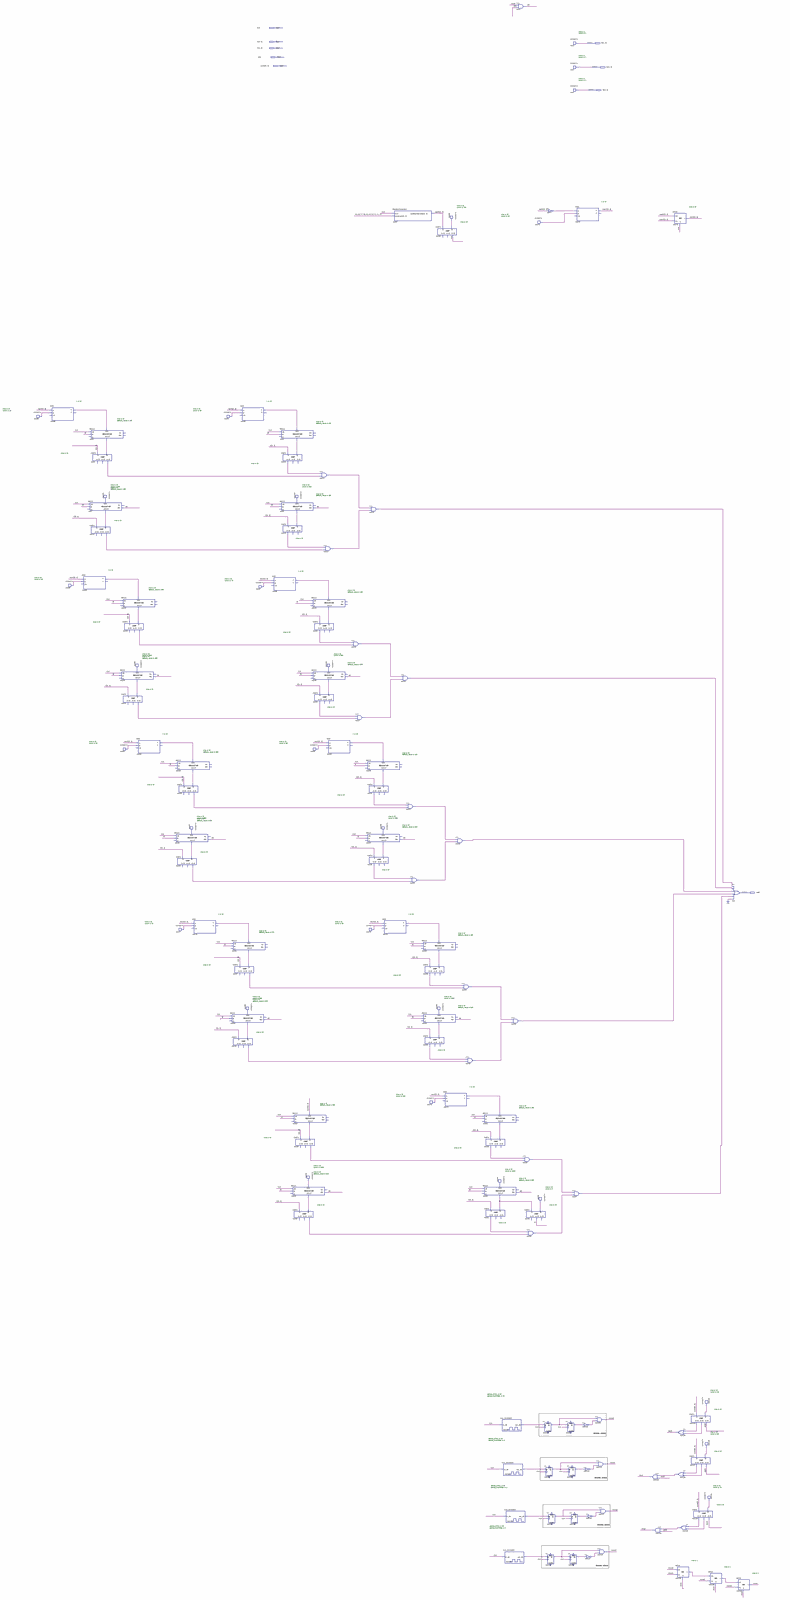
[diagram p0: schematic sheet, whole]
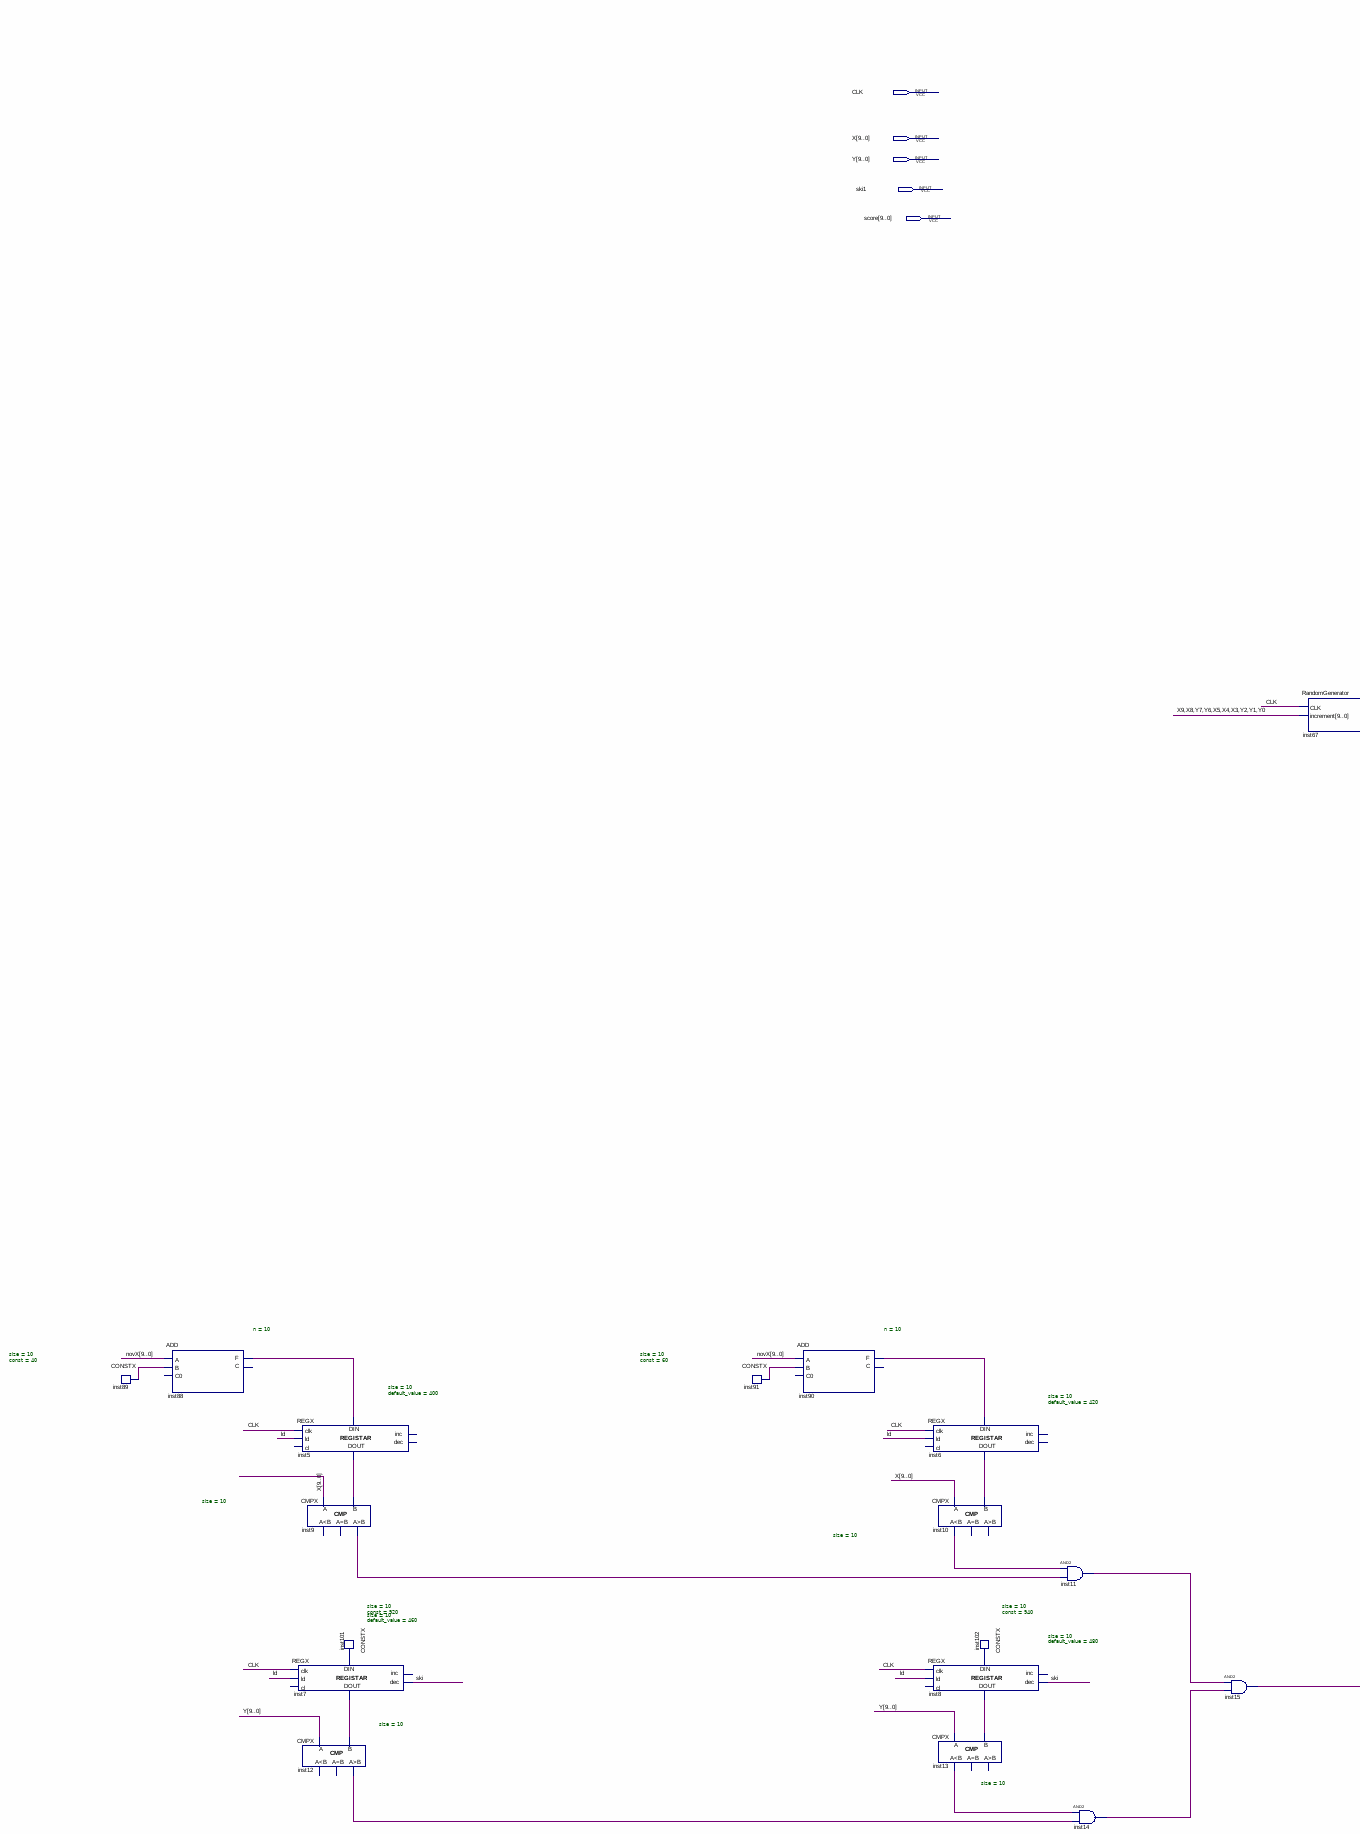
[diagram p1: schematic sheet, upper left part]
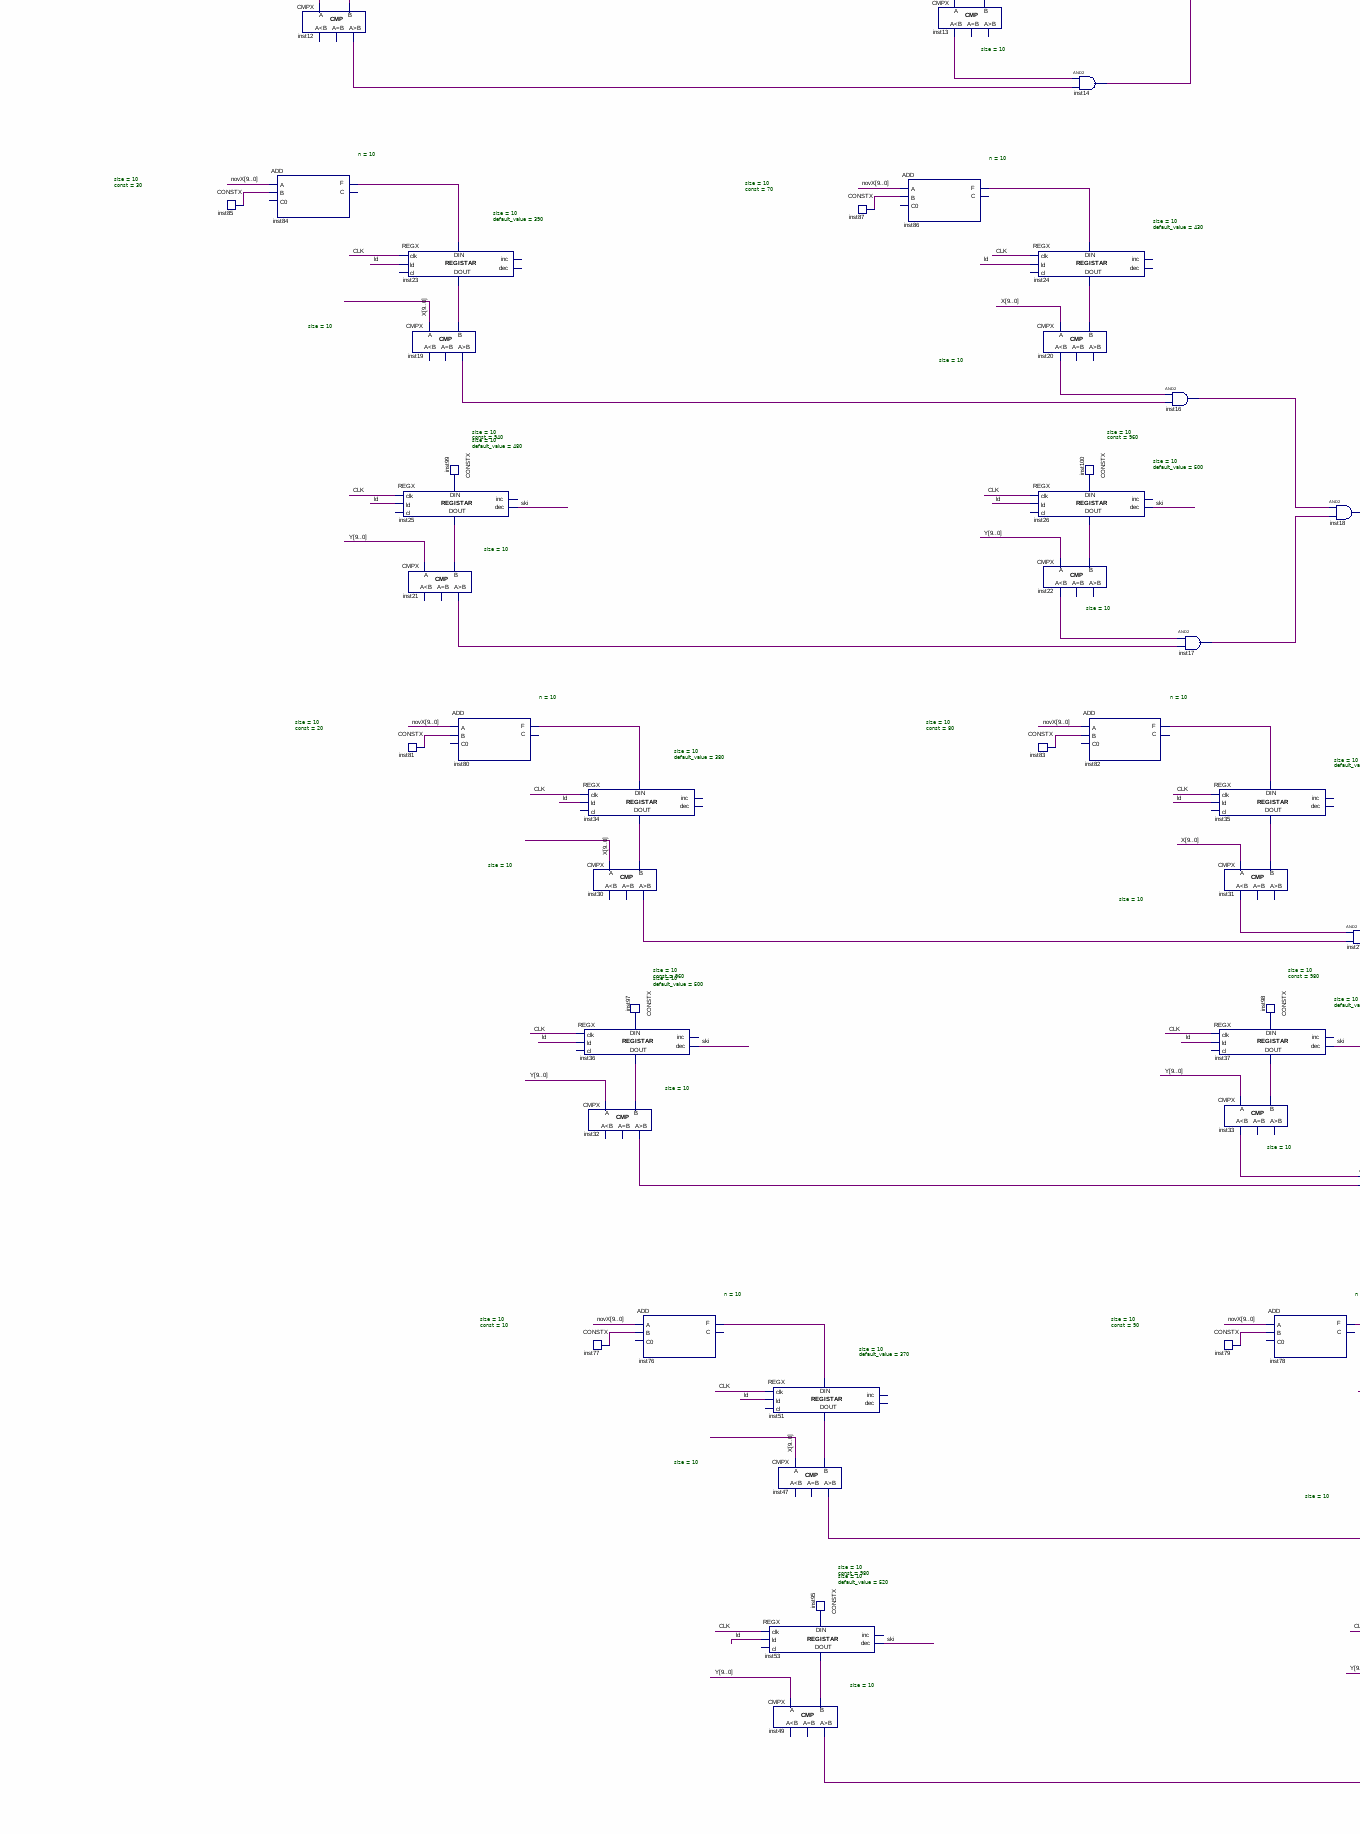
[diagram p2: schematic sheet, middle left part]
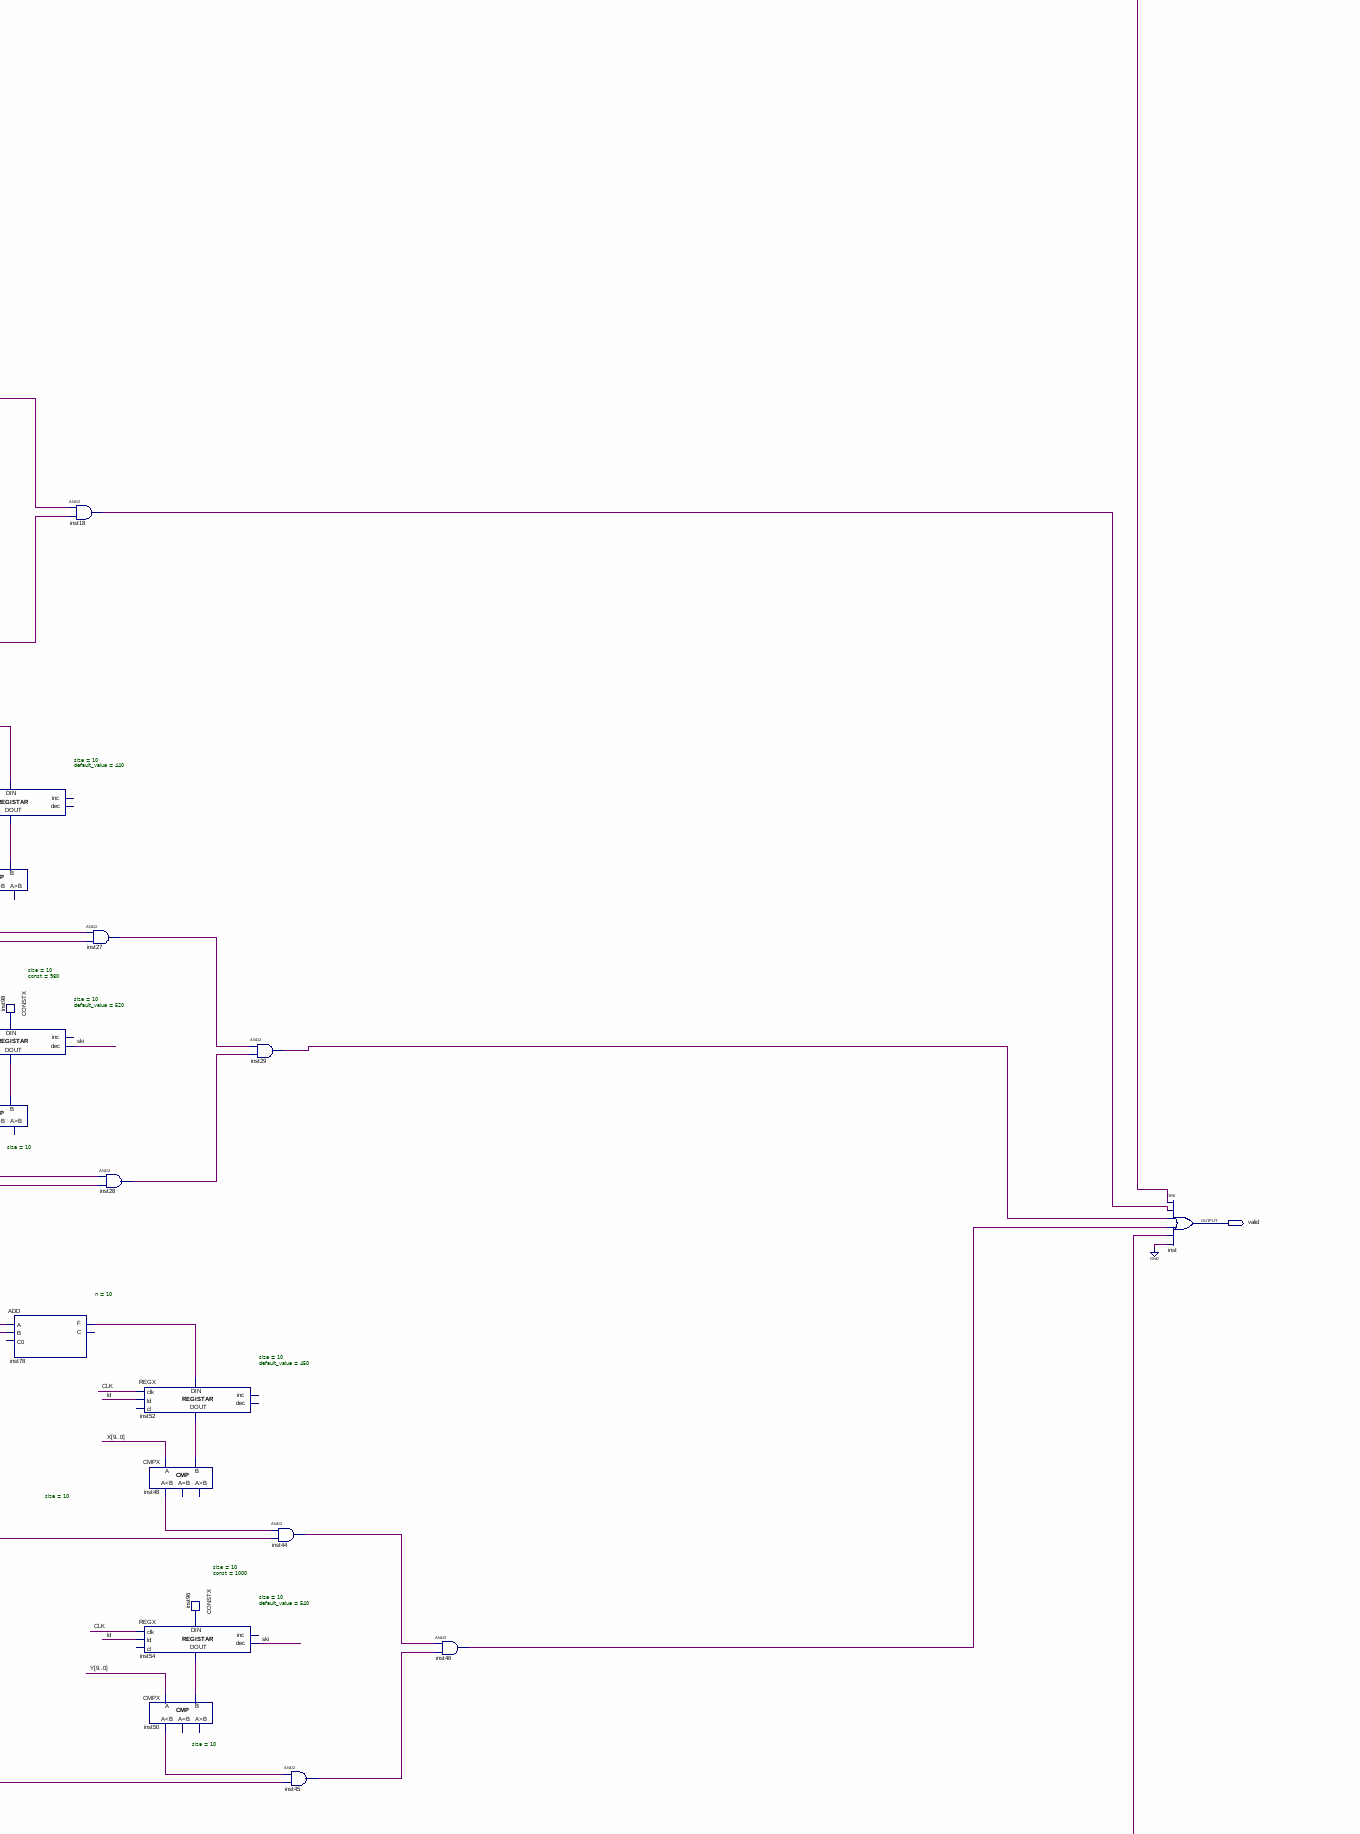
[diagram p3: schematic sheet, middle right part]
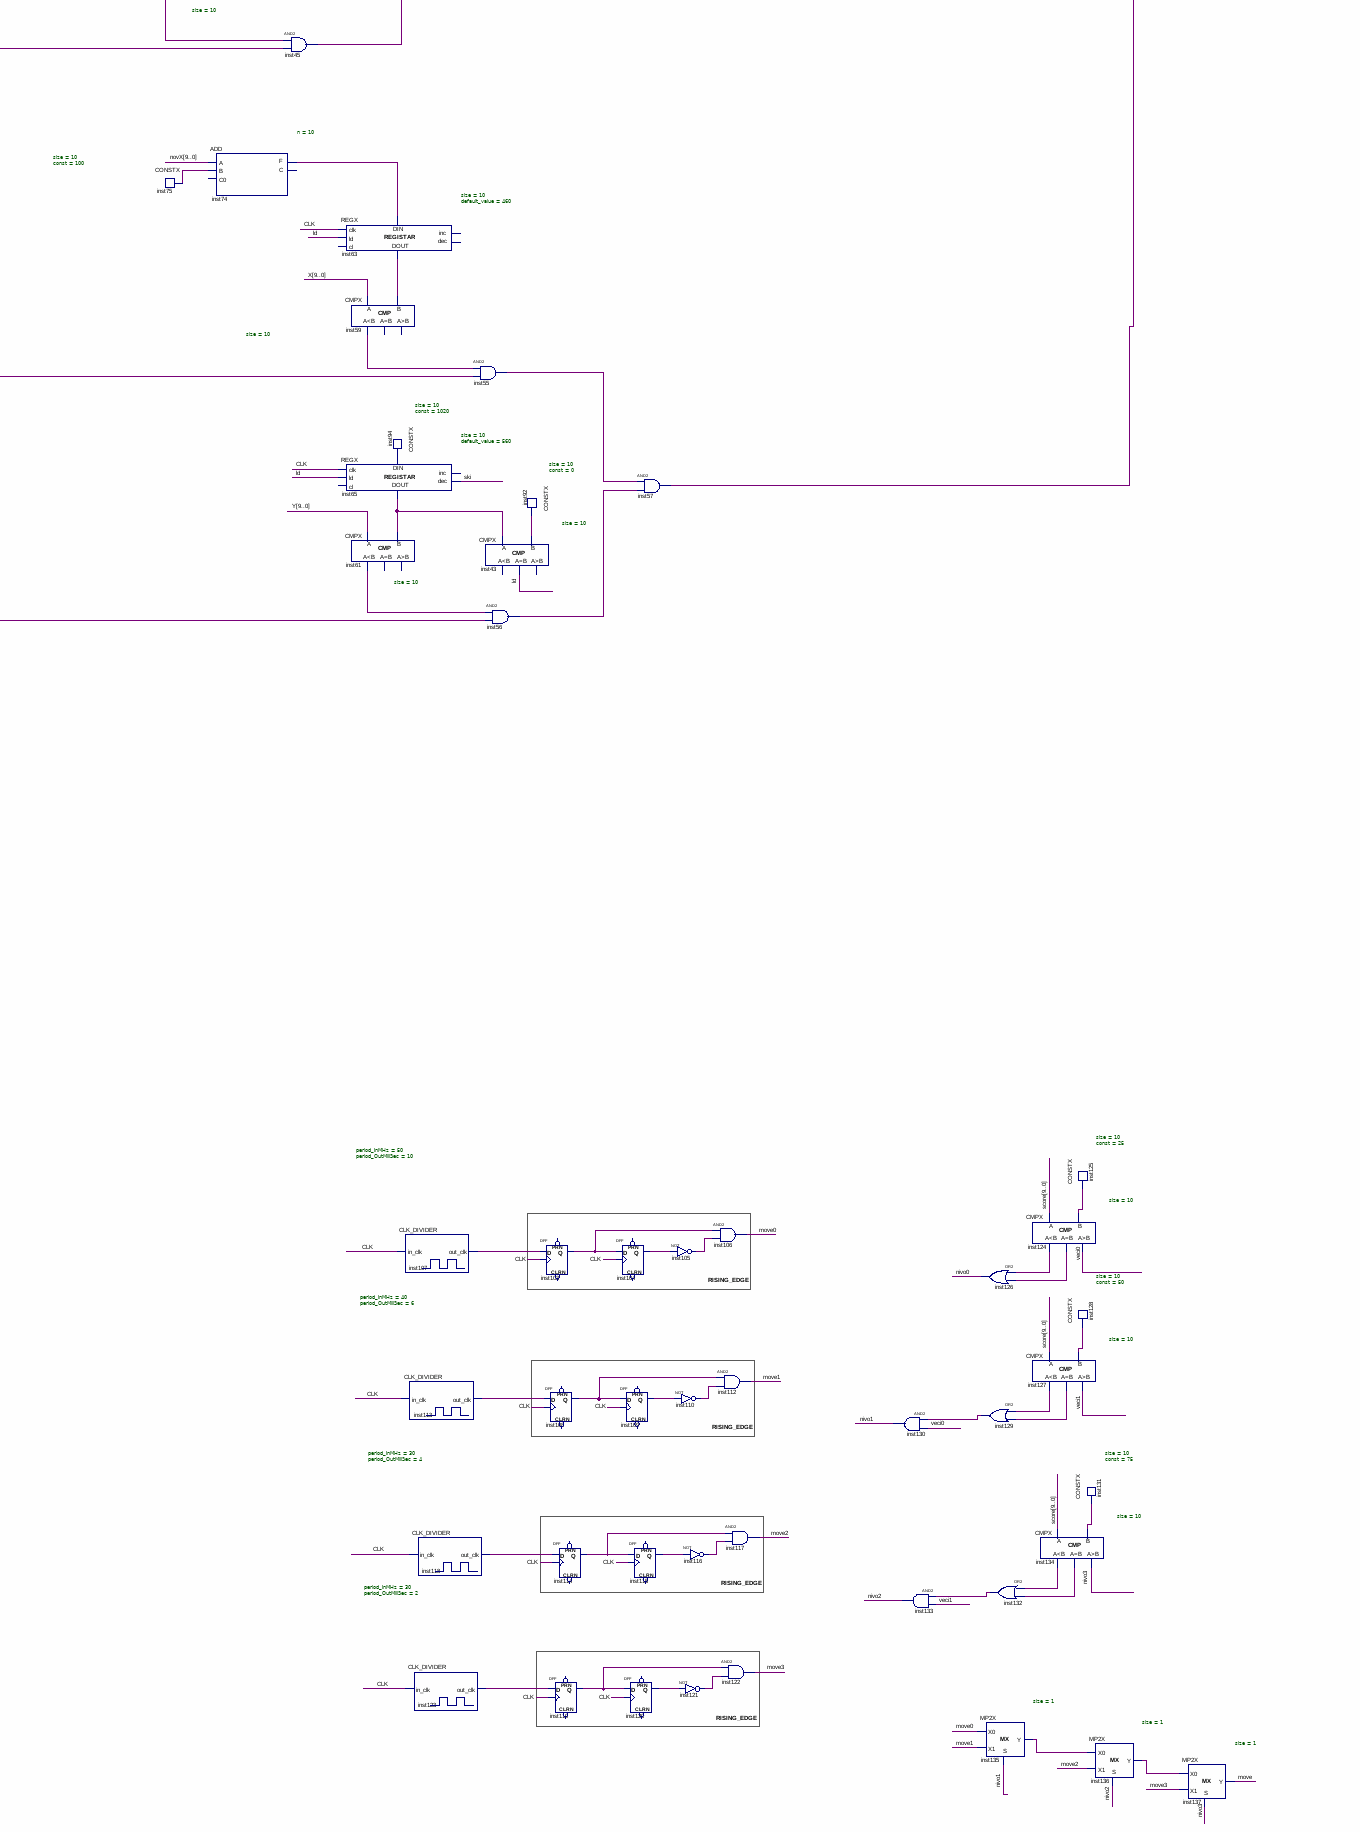
[diagram p4: schematic sheet, lower right part]
// Quartus schematic Jelkica.bdf as structural Verilog: 131 symbols, 9 pins
module Jelkica (
  input  CLK,
  input  [9:0] X,
  input  [9:0] Y,
  input  ski1,
  input  [9:0] score,
  output [3:0] R,
  output [3:0] G,
  output [3:0] B,
  output valid
);

  wire inst9_gr, inst10_ls, inst11_out, inst12_gr, inst13_ls, inst14_out, inst15_out, inst16_out, inst17_out,
       inst18_out, inst19_gr, inst20_ls, inst21_gr, inst22_ls, inst27_out, inst28_out, inst29_out, inst30_gr,
       inst31_ls, inst32_gr, inst33_ls, inst44_out, inst45_out, inst46_out, inst47_gr, inst48_ls, inst49_gr,
       inst50_ls, inst55_out, inst56_out, inst57_out, inst58_gr, inst59_ls, inst60_gr, inst61_ls, inst103_q,
       inst104_q, inst105_out, inst107_out_clk, inst108_q, inst109_q, inst110_out, inst113_out_clk,
       inst114_q, inst115_q, inst116_out, inst118_out_clk, inst119_q, inst120_q, inst121_out,
       inst123_out_clk, inst124_eq, inst124_ls, inst127_eq, inst127_ls, inst129_out, inst132_out, inst134_eq,
       inst134_ls, inst135_y, inst136_y, ld, move, move0, move1, move2, move3, nivo0, nivo1, nivo2, nivo3,
       over, ski, veci0, veci1;
  wire [9:0] inst5_data_out, inst6_data_out, inst7_data_out, inst8_data_out, inst23_data_out,
       inst24_data_out, inst25_data_out, inst26_data_out, inst34_data_out, inst35_data_out, inst36_data_out,
       inst37_data_out, inst51_data_out, inst52_data_out, inst53_data_out, inst54_data_out, inst62_data_out,
       inst63_data_out, inst64_data_out, inst65_data_out, inst69_data, inst71_out, inst72_data, inst74_f,
       inst75_data, inst76_f, inst77_data, inst78_f, inst79_data, inst80_f, inst81_data, inst82_f,
       inst83_data, inst84_f, inst85_data, inst86_f, inst87_data, inst88_f, inst89_data, inst90_f,
       inst91_data, inst92_data, inst93_data, inst94_data, inst95_data, inst96_data, inst97_data,
       inst98_data, inst99_data, inst100_data, inst101_data, inst102_data, inst125_data, inst128_data,
       inst131_data, novX, overX, randX;

  CONSTX #(.size(10), .\const (40)) inst89 (.data(inst89_data));
  ADD #(.n(10)) inst88 (.A(novX), .B(inst89_data), .F(inst88_f));  // open: C0, C
  CONSTX #(.size(10), .\const (30)) inst85 (.data(inst85_data));
  REGX #(.size(10), .default_value(460)) inst7 (
    .clk(CLK), .ld(ld), .dec(ski), .data_in(inst101_data), .data_out(inst7_data_out));  // open: cl, inc
  ADD #(.n(10)) inst84 (.A(novX), .B(inst85_data), .F(inst84_f));  // open: C0, C
  REGX #(.size(10), .default_value(400)) inst5 (
    .clk(CLK), .ld(ld), .data_in(inst88_f), .data_out(inst5_data_out));  // open: cl, inc, dec
  CMPX #(.size(10)) inst9 (.A(X), .B(inst5_data_out), .gr(inst9_gr));  // open: ls, eq
  CMPX #(.size(10)) inst12 (.A(Y), .B(inst7_data_out), .gr(inst12_gr));  // open: ls, eq
  CONSTX #(.size(10), .\const (920)) inst101 (.data(inst101_data));
  REGX #(.size(10), .default_value(390)) inst23 (
    .clk(CLK), .ld(ld), .data_in(inst84_f), .data_out(inst23_data_out));  // open: cl, inc, dec
  CMPX #(.size(10)) inst19 (.A(X), .B(inst23_data_out), .gr(inst19_gr));  // open: ls, eq
  REGX #(.size(10), .default_value(480)) inst25 (
    .clk(CLK), .ld(ld), .dec(ski), .data_in(inst99_data), .data_out(inst25_data_out));  // open: cl, inc
  CMPX #(.size(10)) inst21 (.A(Y), .B(inst25_data_out), .gr(inst21_gr));  // open: ls, eq
  CONSTX #(.size(10), .\const (20)) inst81 (.data(inst81_data));
  CONSTX #(.size(10), .\const (940)) inst99 (.data(inst99_data));
  ADD #(.n(10)) inst80 (.A(novX), .B(inst81_data), .F(inst80_f));  // open: C0, C
  REGX #(.size(10), .default_value(380)) inst34 (
    .clk(CLK), .ld(ld), .data_in(inst80_f), .data_out(inst34_data_out));  // open: cl, inc, dec
  CMPX #(.size(10)) inst30 (.A(X), .B(inst34_data_out), .gr(inst30_gr));  // open: ls, eq
  REGX #(.size(10), .default_value(500)) inst36 (
    .clk(CLK), .ld(ld), .dec(ski), .data_in(inst97_data), .data_out(inst36_data_out));  // open: cl, inc
  CMPX #(.size(10)) inst32 (.A(Y), .B(inst36_data_out), .gr(inst32_gr));  // open: ls, eq
  CONSTX #(.size(10), .\const (10)) inst77 (.data(inst77_data));
  CONSTX #(.size(10), .\const (960)) inst97 (.data(inst97_data));
  ADD #(.n(10)) inst76 (.A(novX), .B(inst77_data), .F(inst76_f));  // open: C0, C
  CONSTX #(.size(10), .\const (60)) inst91 (.data(inst91_data));
  REGX #(.size(10), .default_value(520)) inst53 (
    .clk(CLK), .ld(ld), .dec(ski), .data_in(inst95_data), .data_out(inst53_data_out));  // open: cl, inc
  ADD #(.n(10)) inst90 (.A(novX), .B(inst91_data), .F(inst90_f));  // open: C0, C
  REGX #(.size(10), .default_value(370)) inst51 (
    .clk(CLK), .ld(ld), .data_in(inst76_f), .data_out(inst51_data_out));  // open: cl, inc, dec
  CMPX #(.size(10)) inst47 (.A(X), .B(inst51_data_out), .gr(inst47_gr));  // open: ls, eq
  CMPX #(.size(10)) inst49 (.A(Y), .B(inst53_data_out), .gr(inst49_gr));  // open: ls, eq
  CONSTX #(.size(10), .\const (980)) inst95 (.data(inst95_data));
  CONSTX #(.size(10), .\const (70)) inst87 (.data(inst87_data));
  REGX #(.size(10), .default_value(420)) inst6 (
    .clk(CLK), .ld(ld), .data_in(inst90_f), .data_out(inst6_data_out));  // open: cl, inc, dec
  CMPX #(.size(10)) inst10 (.A(X), .B(inst6_data_out), .ls(inst10_ls));  // open: eq, gr
  REGX #(.size(10), .default_value(480)) inst8 (
    .clk(CLK), .ld(ld), .dec(ski), .data_in(inst102_data), .data_out(inst8_data_out));  // open: cl, inc
  CMPX #(.size(10)) inst13 (.A(Y), .B(inst8_data_out), .ls(inst13_ls));  // open: eq, gr
  ADD #(.n(10)) inst86 (.A(novX), .B(inst87_data), .F(inst86_f));  // open: C0, C
  REGX #(.size(10), .default_value(540)) inst64 (
    .clk(CLK), .ld(ld), .dec(ski), .data_in(inst93_data), .data_out(inst64_data_out));  // open: cl, inc
  CONSTX #(.size(10), .\const (940)) inst102 (.data(inst102_data));
  REGX #(.size(10), .default_value(360)) inst62 (
    .clk(CLK), .ld(ld), .data_in(novX), .data_out(inst62_data_out));  // open: cl, inc, dec
  CMPX #(.size(10)) inst58 (.A(X), .B(inst62_data_out), .gr(inst58_gr));  // open: ls, eq
  CMPX #(.size(10)) inst60 (.A(Y), .B(inst64_data_out), .gr(inst60_gr));  // open: ls, eq
  REGX #(.size(10), .default_value(430)) inst24 (
    .clk(CLK), .ld(ld), .data_in(inst86_f), .data_out(inst24_data_out));  // open: cl, inc, dec
  REGX #(.size(10), .default_value(500)) inst26 (
    .clk(CLK), .ld(ld), .dec(ski), .data_in(inst100_data), .data_out(inst26_data_out));  // open: cl, inc
  CONSTX #(.size(10), .\const (80)) inst83 (.data(inst83_data));
  CONSTX #(.size(10), .\const (1000)) inst93 (.data(inst93_data));
  and inst11 (inst11_out, inst10_ls, inst9_gr);
  CMPX #(.size(10)) inst20 (.A(X), .B(inst24_data_out), .ls(inst20_ls));  // open: eq, gr
  CMPX #(.size(10)) inst22 (.A(Y), .B(inst26_data_out), .ls(inst22_ls));  // open: eq, gr
  and inst14 (inst14_out, inst13_ls, inst12_gr);
  CONSTX #(.size(10), .\const (960)) inst100 (.data(inst100_data));
  ADD #(.n(10)) inst82 (.A(novX), .B(inst83_data), .F(inst82_f));  // open: C0, C
  and inst16 (inst16_out, inst20_ls, inst19_gr);
  and inst17 (inst17_out, inst22_ls, inst21_gr);
  and inst15 (inst15_out, inst11_out, inst14_out);
  REGX #(.size(10), .default_value(440)) inst35 (
    .clk(CLK), .ld(ld), .data_in(inst82_f), .data_out(inst35_data_out));  // open: cl, inc, dec
  CMPX #(.size(10)) inst31 (.A(X), .B(inst35_data_out), .ls(inst31_ls));  // open: eq, gr
  REGX #(.size(10), .default_value(520)) inst37 (
    .clk(CLK), .ld(ld), .dec(ski), .data_in(inst98_data), .data_out(inst37_data_out));  // open: cl, inc
  CMPX #(.size(10)) inst33 (.A(Y), .B(inst37_data_out), .ls(inst33_ls));  // open: eq, gr
  CONSTX #(.size(10), .\const (90)) inst79 (.data(inst79_data));
  CONSTX #(.size(10), .\const (980)) inst98 (.data(inst98_data));
  ADD #(.n(10)) inst78 (.A(novX), .B(inst79_data), .F(inst78_f));  // open: C0, C
  RandomGenerator inst67 (.CLK(CLK), .increment({X[9:8], Y[7:6], X[5:3], Y[2:0]}), .randNumber10bit(randX));
  and inst18 (inst18_out, inst16_out, inst17_out);
  and inst27 (inst27_out, inst31_ls, inst30_gr);
  and inst28 (inst28_out, inst33_ls, inst32_gr);
  REGX #(.size(10), .default_value(450)) inst52 (
    .clk(CLK), .ld(ld), .data_in(inst78_f), .data_out(inst52_data_out));  // open: cl, inc, dec
  CMPX #(.size(10)) inst48 (.A(X), .B(inst52_data_out), .ls(inst48_ls));  // open: eq, gr
  REGX #(.size(10), .default_value(540)) inst54 (
    .clk(CLK), .ld(ld), .dec(ski), .data_in(inst96_data), .data_out(inst54_data_out));  // open: cl, inc
  CMPX #(.size(10)) inst50 (.A(Y), .B(inst54_data_out), .ls(inst50_ls));  // open: eq, gr
  CONSTX #(.size(10), .\const (100)) inst75 (.data(inst75_data));
  CMPX #(.size(10)) inst68 (.A(randX), .B(inst69_data), .gr(over));  // open: ls, eq
  CONSTX #(.size(10), .\const (1000)) inst96 (.data(inst96_data));
  ADD #(.n(10)) inst74 (.A(novX), .B(inst75_data), .F(inst74_f));  // open: C0, C
  CONSTX #(.size(10), .\const (700)) inst69 (.data(inst69_data));
  and inst29 (inst29_out, inst27_out, inst28_out);
  and inst44 (inst44_out, inst48_ls, inst47_gr);
  and inst45 (inst45_out, inst50_ls, inst49_gr);
  REGX #(.size(10), .default_value(460)) inst63 (
    .clk(CLK), .ld(ld), .data_in(inst74_f), .data_out(inst63_data_out));  // open: cl, inc, dec
  CMPX #(.size(10)) inst59 (.A(X), .B(inst63_data_out), .ls(inst59_ls));  // open: eq, gr
  REGX #(.size(10), .default_value(560)) inst65 (
    .clk(CLK), .ld(ld), .dec(ski), .data_in(inst94_data), .data_out(inst65_data_out));  // open: cl, inc
  CMPX #(.size(10)) inst61 (.A(Y), .B(inst65_data_out), .ls(inst61_ls));  // open: eq, gr
  CONSTX #(.size(10), .\const (1020)) inst94 (.data(inst94_data));
  CLK_DIVIDER #(.period_InMHz(50), .period_OutMiliSec(10)) inst107 (.in_clk(CLK), .out_clk(inst107_out_clk));
  CLK_DIVIDER #(.period_InMHz(40), .period_OutMiliSec(6)) inst113 (.in_clk(CLK), .out_clk(inst113_out_clk));
  CLK_DIVIDER #(.period_InMHz(30), .period_OutMiliSec(4)) inst118 (.in_clk(CLK), .out_clk(inst118_out_clk));
  CLK_DIVIDER #(.period_InMHz(30), .period_OutMiliSec(2)) inst123 (.in_clk(CLK), .out_clk(inst123_out_clk));
  and inst46 (inst46_out, inst44_out, inst45_out);
  and inst4 (ski, move, ski1);
  and inst55 (inst55_out, inst59_ls, inst58_gr);
  CMPX #(.size(10)) inst43 (.A(inst65_data_out), .B(inst92_data), .eq(ld));  // open: ls, gr
  CONSTX #(.size(10), .\const (40)) inst72 (.data(inst72_data));
  and inst56 (inst56_out, inst61_ls, inst60_gr);
  CONSTX #(.size(10), .\const (0)) inst92 (.data(inst92_data));
  DFF inst103 (.CLK(CLK), .D(inst107_out_clk), .Q(inst103_q));  // open: CLRN, PRN
  DFF inst108 (.CLK(CLK), .D(inst113_out_clk), .Q(inst108_q));  // open: CLRN, PRN
  assign inst71_out = ~randX;  // NOT inst71, 10 bits wide
  DFF inst114 (.CLK(CLK), .D(inst118_out_clk), .Q(inst114_q));  // open: CLRN, PRN
  DFF inst119 (.CLK(CLK), .D(inst123_out_clk), .Q(inst119_q));  // open: CLRN, PRN
  CONSTX #(.size(4), .\const (2)) inst3 (.data(R));
  CONSTX #(.size(4), .\const (7)) inst1 (.data(G));
  CONSTX #(.size(4), .\const (2)) inst2 (.data(B));
  ADD #(.n(10)) inst70 (.A(inst71_out), .B(inst72_data), .F(overX));  // open: C0, C
  and inst57 (inst57_out, inst55_out, inst56_out);
  DFF inst104 (.CLK(CLK), .D(inst103_q), .Q(inst104_q));  // open: CLRN, PRN
  DFF inst109 (.CLK(CLK), .D(inst108_q), .Q(inst109_q));  // open: CLRN, PRN
  DFF inst115 (.CLK(CLK), .D(inst114_q), .Q(inst115_q));  // open: CLRN, PRN
  DFF inst120 (.CLK(CLK), .D(inst119_q), .Q(inst120_q));  // open: CLRN, PRN
  not inst105 (inst105_out, inst104_q);
  not inst110 (inst110_out, inst109_q);
  not inst121 (inst121_out, inst120_q);
  and inst106 (move0, inst103_q, inst105_out);
  not inst116 (inst116_out, inst115_q);
  and inst112 (move1, inst108_q, inst110_out);
  and inst117 (move2, inst114_q, inst116_out);
  and inst122 (move3, inst119_q, inst121_out);
  and inst130 (nivo1, inst129_out, veci0);
  and inst133 (nivo2, inst132_out, veci1);
  MP2X #(.size(10)) inst73 (.S(over), .X0(randX), .X1(overX), .Y(novX));
  or inst126 (nivo0, inst124_ls, inst124_eq);
  or inst129 (inst129_out, inst127_ls, inst127_eq);
  MP2X #(.size(1)) inst135 (.S(nivo1), .X0(move0), .X1(move1), .Y(inst135_y));
  or inst132 (inst132_out, inst134_ls, inst134_eq);
  CMPX #(.size(10)) inst124 (.A(score), .B(inst125_data), .ls(inst124_ls), .eq(inst124_eq), .gr(veci0));
  CMPX #(.size(10)) inst127 (.A(score), .B(inst128_data), .ls(inst127_ls), .eq(inst127_eq), .gr(veci1));
  CMPX #(.size(10)) inst134 (.A(score), .B(inst131_data), .ls(inst134_ls), .eq(inst134_eq), .gr(nivo3));
  CONSTX #(.size(10), .\const (25)) inst125 (.data(inst125_data));
  CONSTX #(.size(10), .\const (50)) inst128 (.data(inst128_data));
  CONSTX #(.size(10), .\const (75)) inst131 (.data(inst131_data));
  MP2X #(.size(1)) inst136 (.S(nivo2), .X0(inst135_y), .X1(move2), .Y(inst136_y));
  or inst (valid, inst15_out, inst18_out, inst29_out, inst46_out, inst57_out, 1'b0);
  MP2X #(.size(1)) inst137 (.S(nivo3), .X0(inst136_y), .X1(move3), .Y(move));

  // Notes on the sheet:
  //   RISING_EDGE
  //   RISING_EDGE
  //   RISING_EDGE
  //   RISING_EDGE
endmodule
